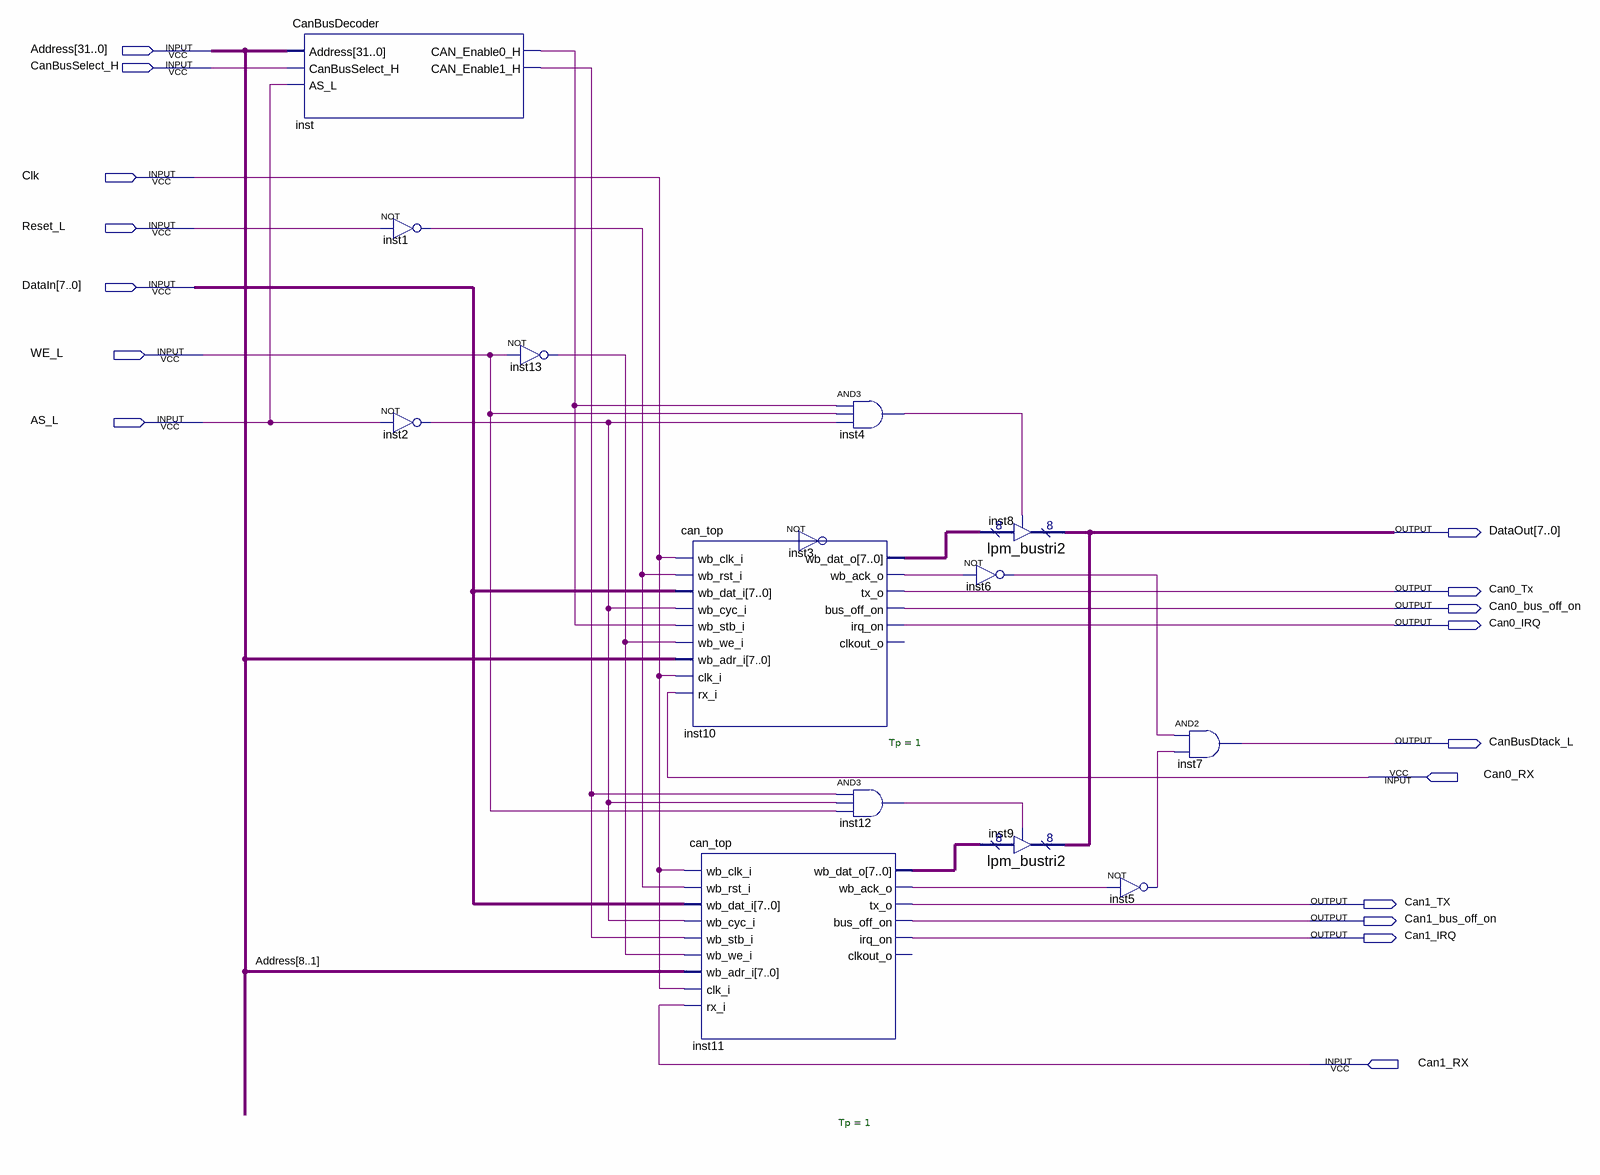
[diagram p0: schematic sheet]
// Quartus schematic CanBus.bdf as structural Verilog: 14 symbols, 17 pins
module CanBus (
  input  [31:0] Address,
  input  CanBusSelect_H,
  input  Clk,
  input  Reset_L,
  input  [7:0] DataIn,
  input  WE_L,
  input  AS_L,
  input  Can0_RX,
  input  Can1_RX,
  output [7:0] DataOut,
  output Can0_Tx,
  output Can0_bus_off_on,
  output Can0_IRQ,
  output CanBusDtack_L,
  output Can1_TX,
  output Can1_bus_off_on,
  output Can1_IRQ
);

  wire inst1_out, inst2_out, inst4_out, inst5_out, inst6_out, inst10_wb_ack_o, inst11_wb_ack_o, inst12_out,
       inst13_out, inst_can_enable0_h, inst_can_enable1_h;
  wire [7:0] inst10_wb_dat_o, inst11_wb_dat_o;

  CanBusDecoder inst (
    .Address(Address), .CanBusSelect_H(CanBusSelect_H), .AS_L(AS_L), .CAN_Enable0_H(inst_can_enable0_h),
    .CAN_Enable1_H(inst_can_enable1_h));
  not inst1 (inst1_out, Reset_L);
  not inst2 (inst2_out, AS_L);
  not inst13 (inst13_out, WE_L);
  can_top #(.Tp(1)) inst10 (
    .wb_clk_i(Clk), .wb_rst_i(inst1_out), .wb_dat_i(DataIn), .wb_cyc_i(inst2_out),
    .wb_stb_i(inst_can_enable0_h), .wb_we_i(inst13_out), .wb_adr_i(Address), .clk_i(Clk), .rx_i(Can0_RX),
    .wb_dat_o(inst10_wb_dat_o), .wb_ack_o(inst10_wb_ack_o), .tx_o(Can0_Tx), .bus_off_on(Can0_bus_off_on),
    .irq_on(Can0_IRQ));  // open: clkout_o
  can_top #(.Tp(1)) inst11 (
    .wb_clk_i(Clk), .wb_rst_i(inst1_out), .wb_dat_i(DataIn), .wb_cyc_i(inst2_out),
    .wb_stb_i(inst_can_enable1_h), .wb_we_i(inst13_out), .wb_adr_i(Address[8:1]), .clk_i(Clk),
    .rx_i(Can1_RX), .wb_dat_o(inst11_wb_dat_o), .wb_ack_o(inst11_wb_ack_o), .tx_o(Can1_TX),
    .bus_off_on(Can1_bus_off_on), .irq_on(Can1_IRQ));  // open: clkout_o
  and inst4 (inst4_out, inst_can_enable0_h, WE_L, inst2_out);
  // NOT inst3 is placed but not wired
  and inst12 (inst12_out, inst_can_enable1_h, inst2_out, WE_L);
  lpm_bustri2 inst8 (.enabledt(inst4_out), .data(inst10_wb_dat_o), .tridata(DataOut));
  not inst6 (inst6_out, inst10_wb_ack_o);
  lpm_bustri2 inst9 (.enabledt(inst12_out), .data(inst11_wb_dat_o), .tridata(DataOut));
  not inst5 (inst5_out, inst11_wb_ack_o);
  and inst7 (CanBusDtack_L, inst6_out, inst5_out);
endmodule
